# EAGLE design micro_RevA (EAGLE 6.5.0)
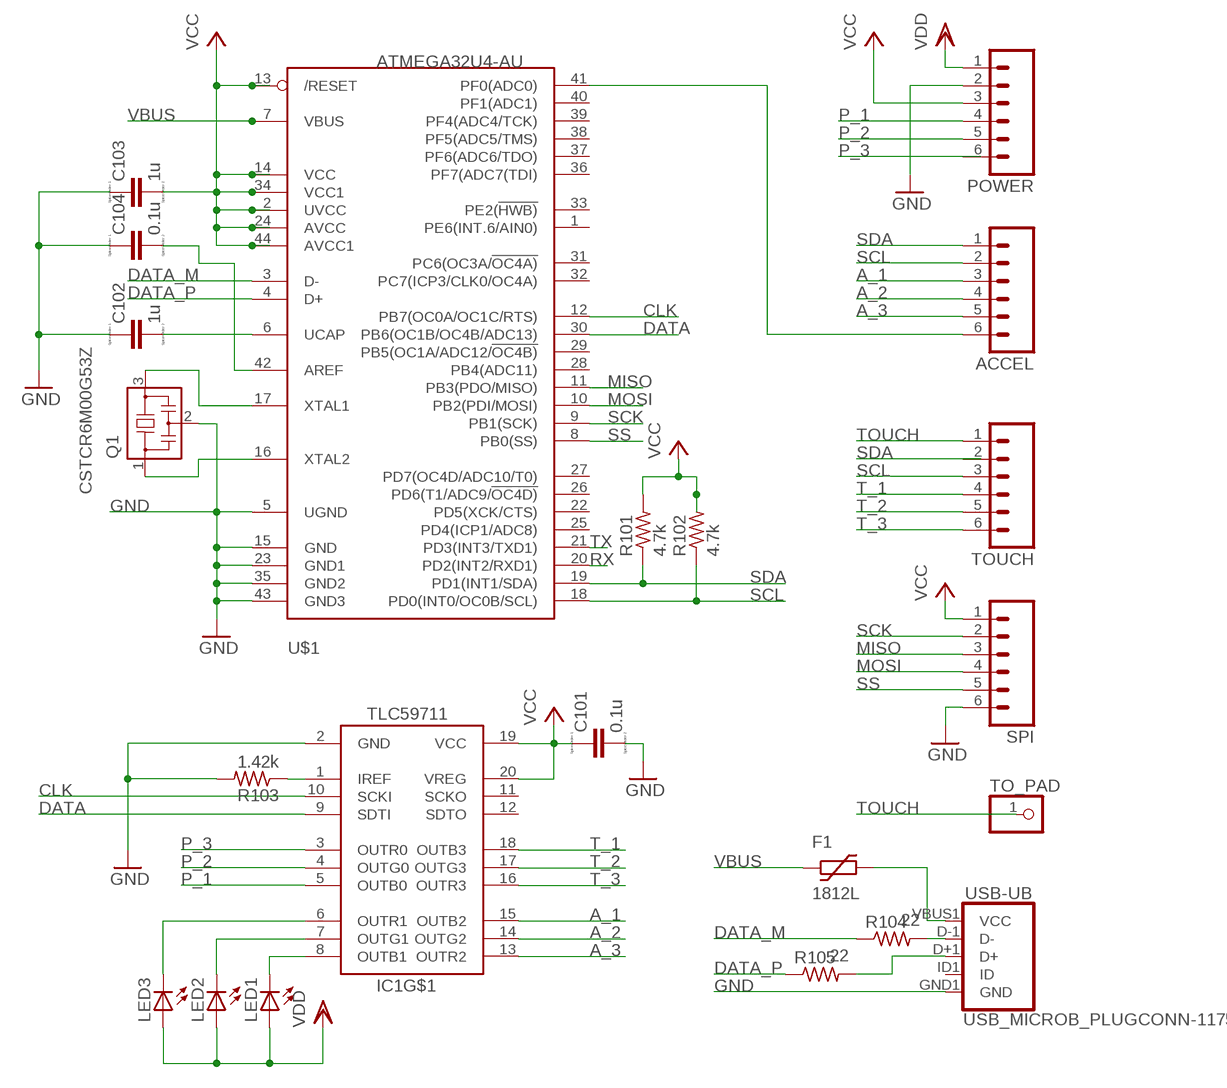
[diagram p0: schematic, sheet 1]

## Parts
ACCEL  M06SMD-STRAIGHT-ALT  [1X06_SMD_STRAIGHT_ALT]
C101  0.1u  CC0603  [C0603]
C102  1u  CC0603  [C0603]
C103  1u  CC0603  [C0603]
C104  0.1u  CC0603  [C0603]
F1  1812L  [1812L]
IC1  TLC59711  [HTSSOP20DAP]
LED1  LEDP-LCC-4  [P-LCC-4]
LED2  LEDP-LCC-4  [P-LCC-4]
LED3  LEDP-LCC-4  [P-LCC-4]
POWER  M06SMD-STRAIGHT-ALT  [1X06_SMD_STRAIGHT_ALT]
Q1  CSTCR6M00G53Z  [CSTCR6M]
R101  4.7k  R-US_R0603  [R0603]
R102  4.7k  R-US_R0603  [R0603]
R103  1.42k  R-US_R0603  [R0603]
R104  22  R-US_R0603  [R0603]
R105  22  R-US_R0603  [R0603]
SPI  M06SMD-STRAIGHT-ALT  [1X06_SMD_STRAIGHT_ALT]
TO_PAD  PINHD-1X1  [1X01]
TOUCH  M06SMD-STRAIGHT-ALT  [1X06_SMD_STRAIGHT_ALT]
U$1  ATMEGA32U4-AU  [TQFP44]
USB-UB  USB_MICROB_PLUGCONN-11752  [USB-B-MICRO-SMD_V03]

## Nets
A_1: ACCEL.3 IC1.15(OUTB2)
A_2: ACCEL.4 IC1.14(OUTG2)
A_3: ACCEL.5 IC1.13(OUTR2)
CLK: IC1.10(SCKI) U$1.12(PB7(OC0A/OC1C/RTS))
DATA: IC1.9(SDTI) U$1.30(PB6(OC1B/OC4B/ADC13))
DATA_M: R104.1 U$1.3(D-)
DATA_P: R105.1 U$1.4(D+)
GND: C101.2 C102.1 C103.1 C104.1 IC1.2(GND) POWER.2 Q1.2 R103.2 SPI.6 U$1.5(UGND) U$1.15(GND) U$1.23(GND1) U$1.35(GND2) U$1.43(GND3) USB-UB.GND1(GND)
MISO: SPI.3 U$1.11(PB3(PDO/MISO))
MOSI: SPI.4 U$1.10(PB2(PDI/MOSI))
N$1: Q1.3 U$1.17(XTAL1)
N$2: Q1.1 U$1.16(XTAL2)
N$3: C104.2 U$1.42(AREF)
N$4: IC1.1(IREF) R103.1
N$5: IC1.6(OUTR1) LED3.C@4(C)
N$6: IC1.7(OUTG1) LED2.C@4(C)
N$7: IC1.8(OUTB1) LED1.C@4(C)
N$8: C102.2 U$1.6(UCAP)
N$9: ACCEL.6 U$1.41(PF0(ADC0))
N$10: R104.2 USB-UB.D-1(D-)
N$11: R105.2 USB-UB.D+1(D+)
N$12: F1.P$2 USB-UB.VBUS1(VCC)
P_1: IC1.5(OUTB0) POWER.4
P_2: IC1.4(OUTG0) POWER.5
P_3: IC1.3(OUTR0) POWER.6
RX: U$1.20(PD2(INT2/RXD1))
SCK: SPI.2 U$1.9(PB1(SCK))
SCL: ACCEL.2 R102.1 TOUCH.3 U$1.18(PD0(INT0/OC0B/SCL))
SDA: ACCEL.1 R101.1 TOUCH.2 U$1.19(PD1(INT1/SDA))
SS: SPI.5 U$1.8(PB0(SS))
T_1: IC1.18(OUTB3) TOUCH.4
T_2: IC1.17(OUTG3) TOUCH.5
T_3: IC1.16(OUTR3) TOUCH.6
TOUCH: TO_PAD.1 TOUCH.1
TX: U$1.21(PD3(INT3/TXD1))
VBUS: F1.P$1 U$1.7(VBUS)
VCC: C101.1 C103.2 IC1.19(VCC) IC1.20(VREG) POWER.3 R101.2 R102.2 SPI.1 U$1.2(UVCC) U$1.13(/RESET) U$1.14(VCC) U$1.24(AVCC) U$1.34(VCC1) U$1.44(AVCC1)
VDD: LED1.A LED2.A LED3.A POWER.1
Unconnected: IC1.11(SCKO) IC1.12(SDTO) IC1.EXP(PAD) U$1.1(PE6(INT.6/AIN0)) U$1.22(PD5(XCK/CTS)) U$1.25(PD4(ICP1/ADC8)) U$1.26(PD6(T1/ADC9/!OC4D)) U$1.27(PD7(OC4D/ADC10/T0)) U$1.28(PB4(ADC11)) U$1.29(PB5(OC1A/ADC12/!OC4B)) U$1.31(PC6(OC3A/!OC4A)) U$1.32(PC7(ICP3/CLK0/OC4A)) U$1.33(PE2(!HWB)) U$1.36(PF7(ADC7(TDI)) U$1.37(PF6(ADC6/TDO)) U$1.38(PF5(ADC5/TMS)) U$1.39(PF4(ADC4/TCK)) U$1.40(PF1(ADC1)) USB-UB.ID1(ID)

## Library data of the parts
ACCEL POWER SPI TOUCH = SparkFun-Connectors:M06: Header 6 Standard 6-pin 0.1" header. Use with straight break away headers (SKU : PRT-00116), right angle break away headers (PRT-00553), swiss pins (PRT-00743), machine pins (PRT-00117), and female headers (PRT-00115). Molex polarized connector foot print use with SKU : PRT-08094 with associated crimp pins and housings. NOTES ON THE VARIANTS LOCK and LOCK_LONGPADS... This footprint was designed to help hold the alignment of a through-hole component (i.e. 6-pin header) while soldering it into place. You may notice that each hole has been shifted either up or down by 0.005 of an inch from it's more standard position (which is a perfectly straight line). This slight alteration caused the pins (the squares in the middle) to touch the edges of the holes. Because they are alternating, it causes a "brace" to hold the component in place. 0.005 has proven to be the perfect amount of "off-center" position when using our standard breakaway headers. Although looks a little odd when you look at the bare footprint, once you have a header in there, the alteration is very hard to notice. Also,if you push a header all the way into place, it is covered up entirely on the bottom side. This idea of altering the position of holes to aid alignment will be further integrated into the Sparkfun Library for other footprints. It can help hold any component with 3 or more connection pins.
C101-C104 = eagle-ltspice:C: CAPACITOR, European symbol; SPICEMODEL: NONE; SPICEPREFIX: C
F1 = ptc-littlefuse:1812L
IC1 = adafruit:TLC59711
LED1-LED3 = led:LED: LED OSRAM: - CHIPLED LG R971, LG N971, LY N971, LG Q971, LY Q971, LO R971, LY R971 LH N974, LH R974 LS Q976, LO Q976, LY Q976 LO Q996 - Hyper CHIPLED LW Q18S LB Q993, LB Q99A, LB R99A - SideLED LS A670, LO A670, LY A670, LG A670, LP A670 LB A673, LV A673, LT A673, LW A673 LH A674 LY A675 LS A676, LA A676, LO A676, LY A676, LW A676 LS A679, LY A679, LG A679 - Hyper Micro SIDELED® LS Y876, LA Y876, LO Y876, LY Y876 LT Y87S - SmartLED LW L88C, LW L88S LB L89C, LB L89S, LG L890 LS L89K, LO L89K, LY L89K LS L896, LA L896, LO L896, LY L896 - TOPLED LS T670, LO T670, LY T670, LG T670, LP T670 LSG T670, LSP T670, LSY T670, LOP T670, LYG T670 LG T671, LOG T671, LSG T671 LB T673, LV T673, LT T673, LW T673 LH T674 LS T676, LA T676, LO T676, LY T676, LB T676, LH T676, LSB T676, LW T676 LB T67C, LV T67C, LT T67C, LS T67K, LO T67K, LY T67K, LW E67C LS E67B, LA E67B, LO E67B, LY E67B, LB E67C, LV E67C, LT E67C LW T67C LS T679, LY T679, LG T679 LS T770, LO T770, LY T770, LG T770, LP T770 LB T773, LV T773, LT T773, LW T773 LH T774 LS E675, LA E675, LY E675, LS T675 LS T776, LA T776, LO T776, LY T776, LB T776 LHGB T686 LT T68C, LB T68C - Hyper Mini TOPLED® LB M676 - Mini TOPLED Santana® LG M470 LS M47K, LO M47K, LY M47K Source: http://www.osram.convergy.de LUXEON: - LUMILED® LXK2-PW12-R00, LXK2-PW12-S00, LXK2-PW14-U00, LXK2-PW14-V00 LXK2-PM12-R00, LXK2-PM12-S00, LXK2-PM14-U00 LXK2-PE12-Q00, LXK2-PE12-R00, LXK2-PE12-S00, LXK2-PE14-T00, LXK2-PE14-U00 LXK2-PB12-K00, LXK2-PB12-L00, LXK2-PB12-M00, LXK2-PB14-N00, LXK2-PB14-P00, LXK2-PB14-Q00 LXK2-PR12-L00, LXK2-PR12-M00, LXK2-PR14-Q00, LXK2-PR14-R00 LXK2-PD12-Q00, LXK2-PD12-R00, LXK2-PD12-S00 LXK2-PH12-R00, LXK2-PH12-S00 LXK2-PL12-P00, LXK2-PL12-Q00, LXK2-PL12-R00 Source: www.luxeon.com KINGBRIGHT: KA-3528ASYC Source: www.kingbright.com
Q1 = murata-filter:CSTCR: Resonator Source: murata.co.jp; MPN: CSTCR6M00G53-R0; OC_FARNELL: 1170434; OC_NEWARK: 25M8759
R101-R105 = resistor:R-US_: RESISTOR, American symbol
TO_PAD = pinhead:PINHD-1X1: PIN HEADER
U$1 = adafruit:ATMEGA32U4: http://www.ladyada.net/library/eagle
USB-UB = SparkFun-Connectors:USB_MICROB_PLUG: USB Micro-B connectors Some male, some female. Watch your step!; PROD_ID: CONN-11752

## Board
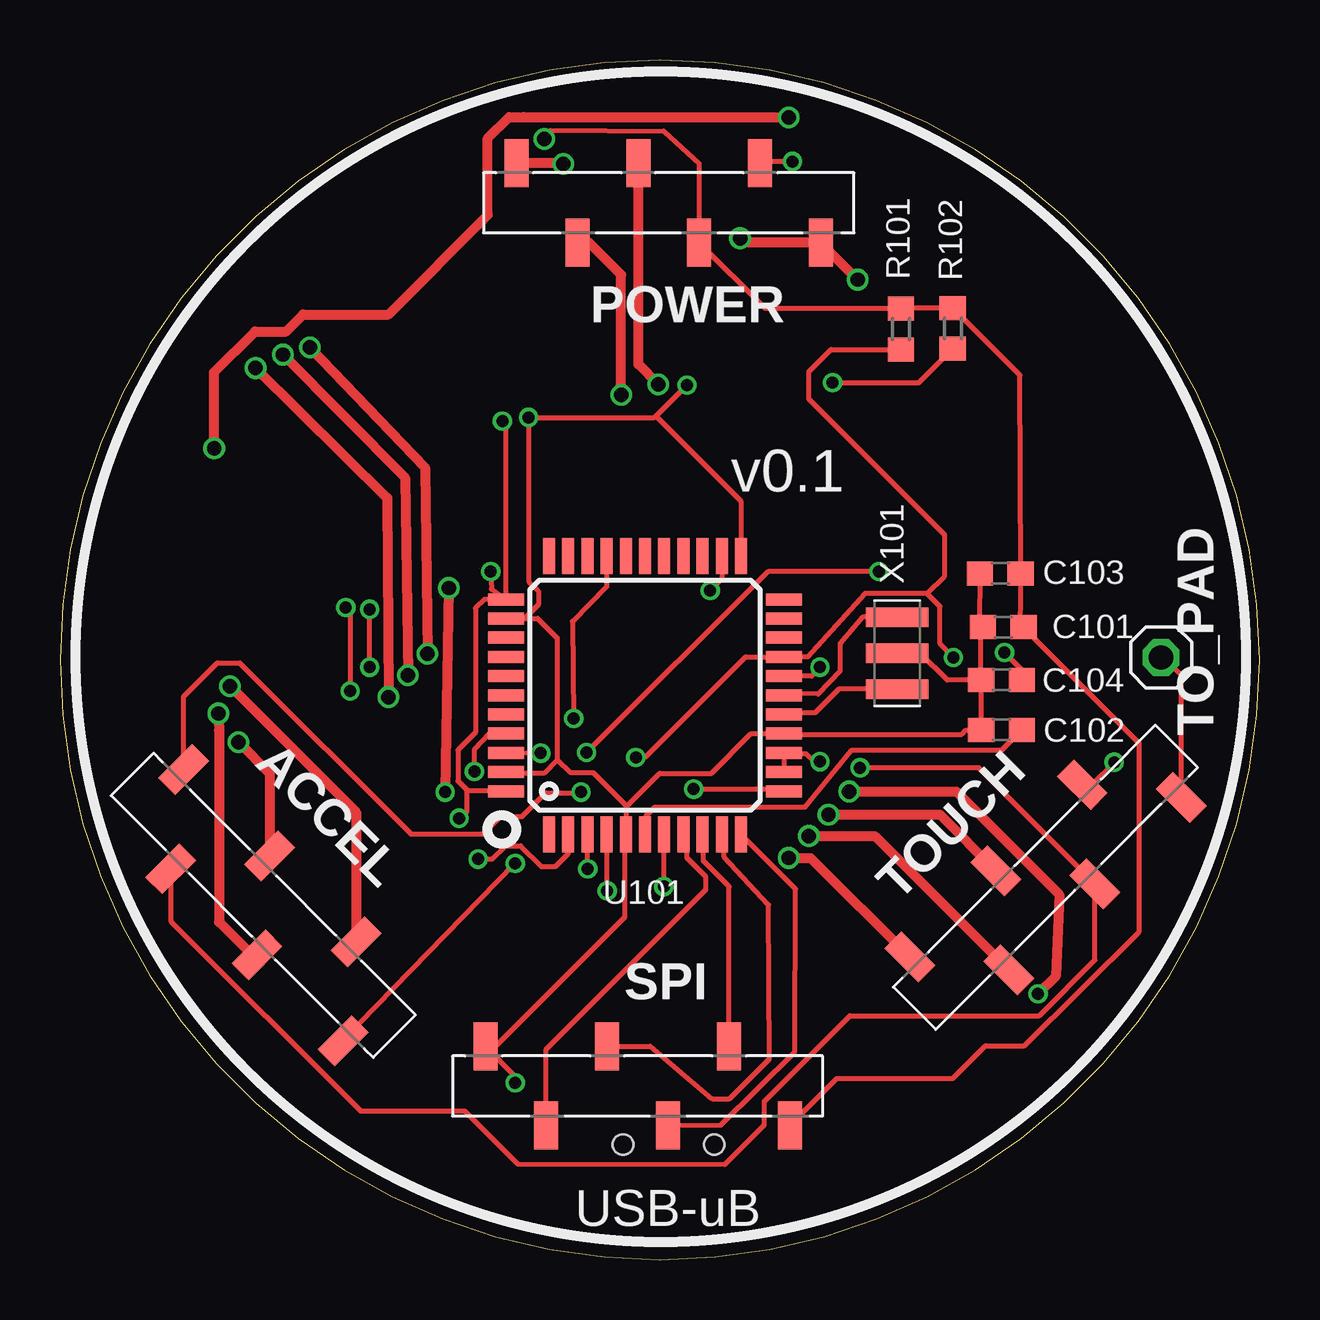
[diagram p1: board, top side]
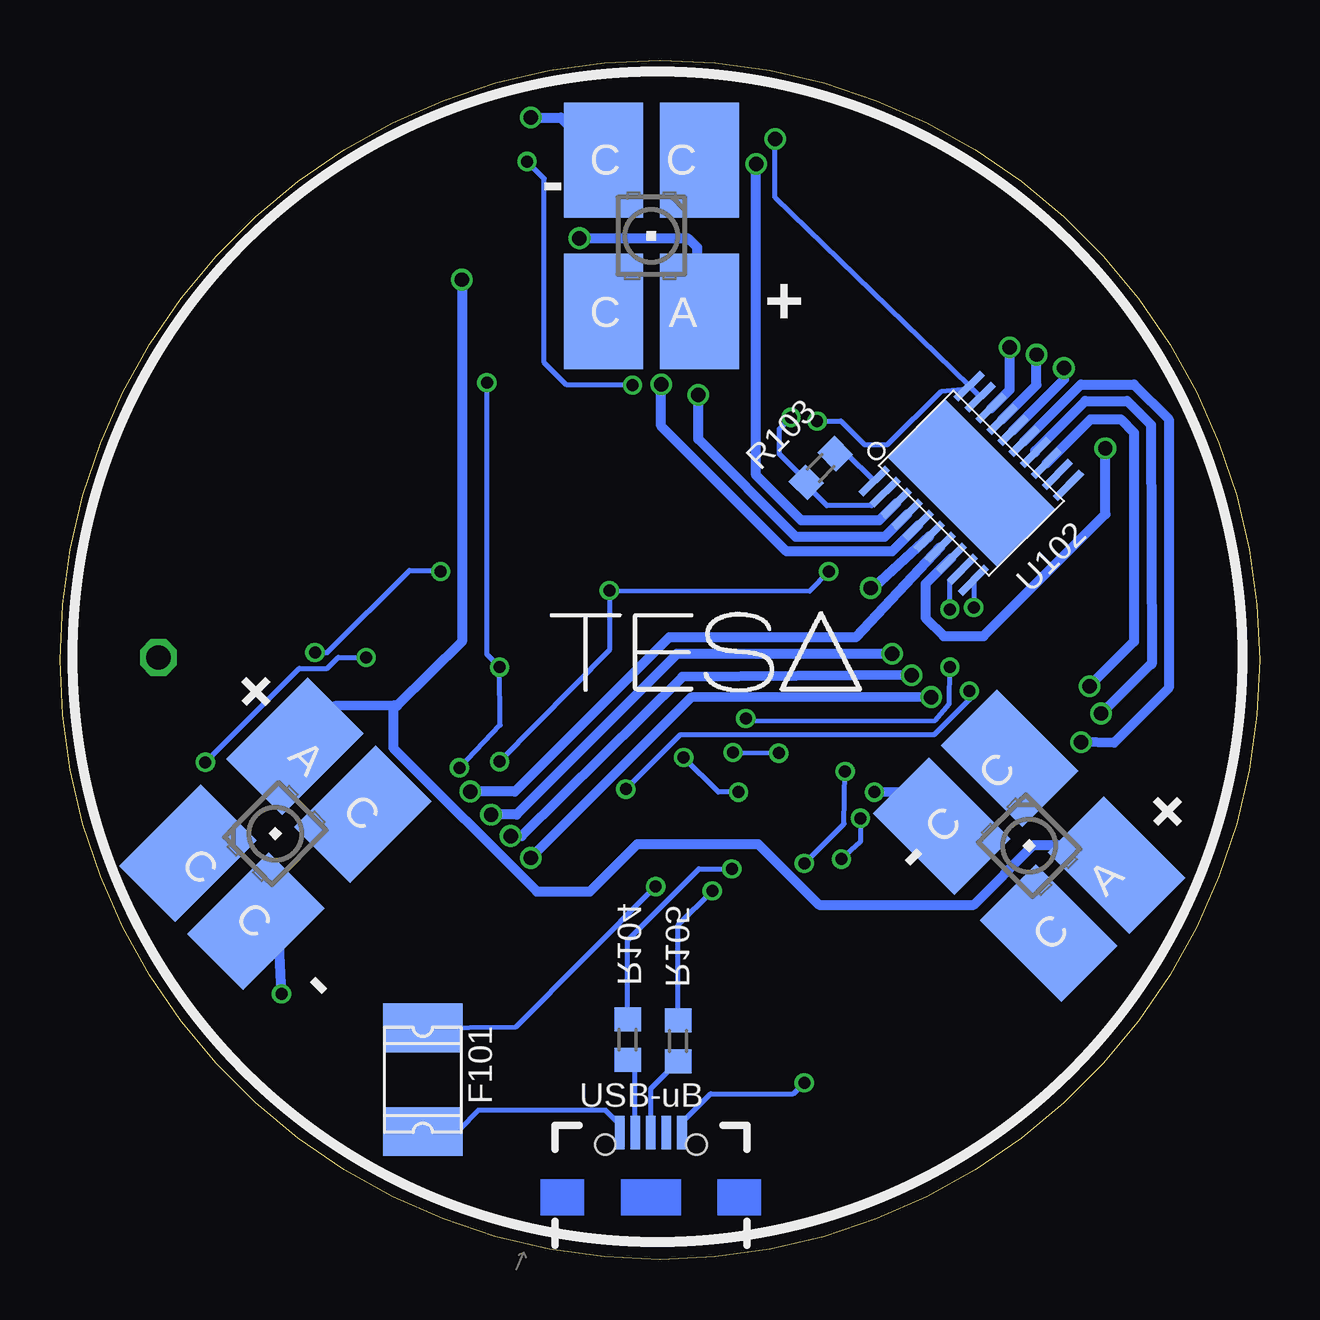
[diagram p2: board, bottom side, seen from below]

Size 50 x 50 mm. Coordinates in mm from the lower left corner, seen from the top.
Outline: 0,25 arc90 25,0 arc90 50,25 arc90 25,50 arc90 0,25
Copper layers (1*16): Top 0.035mm / dielectric 1.5mm / Bottom 0.035mm
Design rules "ITEADstudio_DRC": minimum track width 6mil, minimum drill 12mil, track to track 6mil, track to pad 6mil, pad to pad 6mil, via to via 6mil, smd to smd 0mil, copper to edge 10mil, drill to drill 10mil, minimum pad ring 10mil, minimum via ring 6mil, stop-mask expansion 2mil, vias tented up to drill 100mil, thermal gap 10mil

### Footprints (pad centres in the part's own frame; a part is rotated, then mirrored left to right if it is on the bottom)
1X06_SMD_STRAIGHT_ALT = smd 1 x 2: 1 0,-1.65; 2 -2.54,1.65; 3 -5.08,-1.65; 4 -7.62,1.65; 5 -10.16,-1.65; 6 -12.7,1.65
C0603 = smd 1.1 x 1: 1 -0.85,0; 2 0.85,0
1812L = smd 2.03 x 3.3: P$1 -2.16,0; P$2 2.16,0
HTSSOP20DAP = smd 0.3 x 1.55: 1 -2.925,-2.8; 2 -2.275,-2.8; 3 -1.625,-2.8; 4 -0.975,-2.8; 5 -0.325,-2.8; 6 0.325,-2.8; 7 0.975,-2.8; 8 1.625,-2.8; 9 2.275,-2.8; 10 2.925,-2.8; 11 2.925,2.8; 12 2.275,2.8; 13 1.625,2.8; 14 0.975,2.8; 15 0.325,2.8; 16 -0.325,2.8; 17 -0.975,2.8; 18 -1.625,2.8; 19 -2.275,2.8; 20 -2.925,2.8 | smd 6.5 x 3.4: EXP 0,0
P-LCC-4 = smd 3.3 x 4.8: A -2,3.15; C@1 -2,-3.15; C@3 2,3.15; C@4 2,-3.15
CSTCR6M = smd 0.8 x 2.6: 1 -1.5,0; 2 0,0; 3 1.5,0
R0603 = smd 1 x 1.1: 1 -0.85,0; 2 0.85,0
1X01 = drill 1.016 octagon: 1 0,0
TQFP44 = smd 1.5 x 0.5: 1 -5.8,4; 2 -5.8,3.2; 3 -5.8,2.4; 4 -5.8,1.6; 5 -5.8,0.8; 6 -5.8,0; 7 -5.8,-0.8; 8 -5.8,-1.6; 9 -5.8,-2.4; 10 -5.8,-3.2; 11 -5.8,-4; 23 5.8,-4; 24 5.8,-3.2; 25 5.8,-2.4; 26 5.8,-1.6; 27 5.8,-0.8; 28 5.8,0; 29 5.8,0.8; 30 5.8,1.6; 31 5.8,2.4; 32 5.8,3.2; 33 5.8,4 | smd 0.5 x 1.5: 12 -4,-5.8; 13 -3.2,-5.8; 14 -2.4,-5.8; 15 -1.6,-5.8; 16 -0.8,-5.8; 17 0,-5.8; 18 0.8,-5.8; 19 1.6,-5.8; 20 2.4,-5.8; 21 3.2,-5.8; 22 4,-5.8; 34 4,5.8; 35 3.2,5.8; 36 2.4,5.8; 37 1.6,5.8; 38 0.8,5.8; 39 0,5.8; 40 -0.8,5.8; 41 -1.6,5.8; 42 -2.4,5.8; 43 -3.2,5.8; 44 -4,5.8
USB-B-MICRO-SMD_V03 = smd 1.4 x 0.4: D+1 2.7,0; D-1 2.7,0.65; GND1 2.7,-1.3; ID1 2.7,-0.65; VBUS1 2.7,1.3 | hole 0.85: 2.2,1.9; 2.2,-1.9

### Placement (x,y rotation side)
ACCEL  3.99,19.25 135 top
C101  39.32,26.37 180 top
C102  39.24,22.07 0 top
C103  39.19,28.6 0 top
C104  39.24,24.16 0 top
F1  34.87,7.49 270 bottom
IC1  12.01,32.36 315 bottom
LED1  25.35,42.67 180 bottom
LED2  41.02,17.75 315 bottom
LED3  9.6,17.25 225 bottom
POWER  31.72,44.04 0 top
Q1  34.9,25.27 90 top
R101  35.05,38.79 90 top
R102  37.21,38.81 90 top
R103  18.29,32.99 225 bottom
R104  26.34,9.17 270 bottom
R105  24.23,9.12 270 bottom
SPI  30.43,7.24 0 top
TO_PAD  45.9,25.1 0 top
TOUCH  45.57,20.42 45 top
U$1  24.38,23.52 90 top
USB-UB  25.37,2.59 90 bottom

### Tracks (layer width: path | path; a pad name or v marks a point on that pad's centre or on a via)
A_1  (via drill 0.6)
  Top 0.406: v7.44,21.57 8.75,20.26 ACCEL.3
  Bottom 0.406: IC1.15 7.44,36.47 5.23,36.47 3.79,35.03 3.79,23.82 6.07,21.54 v7.44,21.57
A_2  (via drill 0.6)
  Top 0.406: v6.6,22.76 6.63,22.07 6.63,14.07 8,12.7 ACCEL.4
  Bottom 0.406: IC1.14 9.35,33.71 7.26,35.79 5.51,35.79 4.52,34.8 4.5,24.82 4.57,24.79 v6.6,22.76
A_3  (via drill 0.6)
  Top 0.406: v7.09,23.9 12.34,18.65 ACCEL.5
  Bottom 0.406: IC1.13 8.87,33.19 7.04,35.03 5.79,35.03 5.23,34.47 5.23,25.76 v7.09,23.9
CLK  (via drill 0.5)
  Top 0.203: v11.91,27.18 12.09,27 v12.09,23.7 | v26.42,19.61 30.1,19.61 U$1.12
  Bottom 0.203: IC1.10 11.91,28.3 v11.91,27.18 | v12.09,23.7 12.09,23.34 13.56,21.87 24.16,21.87 v26.42,19.61
DATA  (via drill 0.5)
  Top 0.203: U$1.30 22.78,28.04 21.36,26.59 v21.41,22.55 | v12.9,24.69 v12.9,27.1
  Bottom 0.203: v21.41,22.55 21.41,22.45 13.51,22.48 12.93,23.16 v12.9,24.69 | v12.9,27.1 12.9,28.32 12.45,28.77 IC1.9
DATA_M  (via drill 0.5)
  Top 0.203: v22,16.28 22,17.71 U$1.3
  Bottom 0.203: R104.1 26.34,13.31 23.37,16.28 v22,16.28
DATA_P  (via drill 0.5)
  Top 0.203: v22.81,15.37 22.81,17.7 U$1.4
  Bottom 0.203: R105.1 24.23,13.95 v22.81,15.37
GND  (via drill 0.5)
  Top 0.203: C104.1 36.98,24.16 35.89,25.25 34.92,25.25 Q1.2 | C104.1 38.39,26.29 C101.2 38.32,26.52 C103.1 | C104.1 C102.1 37.77,22.07 37.59,21.89 30.21,21.89 U$1.15 28.8,21.92 27.15,20.27 25,20.27 23.58,18.86 | 19.36,26.72 19.94,27.3 19.94,27.86 19.53,28.27 v19.53,35.1 24.79,35.1 24.84,35.15 | 19.36,26.72 U$1.35 | 24.84,35.15 v26.14,36.45 | v18.97,7.37 18.97,7.64 SPI.6 18.16,8.89 23.55,14.28 23.55,17.68 U$1.5 23.58,18.86 | 19.36,26.72 19.91,26.72 20.73,25.91 20.73,20.85 | 20.73,20.85 20.73,20.83 20.17,20.27 18.64,20.27 U$1.43 | 20.73,20.85 21.29,20.3 22.23,20.3 23.58,18.94 23.58,18.86 | v30.53,45.77 29.26,45.77 POWER.2 | 24.84,35.15 28.38,31.61 U$1.23
  Bottom 0.203: IC1.2 16.17,31.42 18.03,31.42 18.89,32.27 R103.2 18.89,32.45 20.02,33.58 20.02,34.62 v19.53,35.1 | v26.14,36.45 28.88,36.45 29.82,37.39 29.82,45.06 v30.53,45.77 | USB-UB.GND1 24.07,5.72 22.89,6.91 19.43,6.91 v18.97,7.37
MISO
  Top 0.203: SPI.3 27.56,5.61 30.63,8.66 30.66,15.45 U$1.11
MOSI
  Top 0.203: SPI.4 24.61,8.89 27.18,6.71 27.91,6.71 29.57,8.36 29.54,14.78 27.69,16.79 27.69,17.62 U$1.10
N$1
  Top 0.203: Q1.3 33.45,26.77 32.51,25.68 32.51,24.54 31.6,23.57 30.26,23.6 U$1.17
N$2
  Top 0.203: Q1.1 32.46,23.77 31.47,22.78 30.25,22.78 U$1.16
N$3  (via drill 0.5)
  Top 0.203: C104.2 40.09,24.57 v39.37,25.3 | v34.14,28.68 29.52,28.68 v21.95,21.13 | v20.04,21.11 18.62,21.08 U$1.42
  Bottom 0.203: v39.37,25.3 38.86,25.3 35.43,28.73 34.19,28.73 v34.14,28.68 | v21.95,21.13 v20.04,21.11
N$4
  Bottom 0.203: IC1.1 17.21,33.6 R103.1
N$5  (via drill 0.5, 0.6)
  Top 0.406: v16.2,27.99 v16.05,19.48
  Bottom 0.406: IC1.6 16.08,28.04 v16.2,27.99 | v16.05,19.48 14.66,19.51 14.2,19.05 14.17,18.99 LED3.C@4
N$6  (via drill 0.5, 0.6)
  Top 0.406: v32.89,19.51 37.36,19.51 41.66,15.21 41.5,11.81 v40.77,11.07
  Bottom 0.406: IC1.7 16.83,25.93 24.61,25.93 31.04,19.51 v32.89,19.51 | v40.77,11.07 40.87,13.15 LED2.C@4
N$7  (via drill 0.6)
  Top 0.406: v6.43,33.81 6.43,36.98 8.13,38.68 9.42,38.68 10.13,39.4 13.69,39.4 17.83,43.54 17.83,46.74 18.72,47.62 19.3,47.62 19.33,47.62 30.35,47.62 v30.38,47.6
  Bottom 0.406: IC1.8 13.92,28.16 13.92,26.75 13.16,25.98 11.51,25.98 6.43,31.06 v6.43,33.81 | v30.38,47.6 29.13,47.6 LED1.C@4
N$8
  Top 0.203: C102.2 39.23,21.21 32.97,21.21 31.04,18.85 24.79,18.85 24.41,18.47 24.41,17.75 U$1.6
N$9  (via drill 0.5)
  Top 0.203: ACCEL.6 11.75,9.1 v18.97,16.51 | v17.27,20.34 17.27,21.26 17.93,21.95 18.56,21.95 U$1.41
  Bottom 0.203: v18.97,16.51 17.32,18.16 v17.27,20.34
N$10
  Bottom 0.203: USB-UB.D-1 26.02,8 R104.2
N$11
  Bottom 0.203: USB-UB.D+1 25.38,7.13 R105.2
N$12
  Bottom 0.203: USB-UB.VBUS1 26.68,5.64 27.25,6.22 32.56,6.22 33.35,5.44 34.77,5.44 F1.P$2
P_1  (via drill 0.6)
  Top 0.406: v24.94,36.47 24.11,37.31 POWER.4
  Bottom 0.406: IC1.5 15.32,29.52 19.71,29.52 24.94,34.75 v24.94,36.47
P_2  (via drill 0.6)
  Top 0.406: v23.39,36.04 23.39,41.05 22.05,42.39 POWER.5
  Bottom 0.406: IC1.4 15.63,30.12 19.33,30.12 23.39,34.19 v23.39,36.04
P_3  (via drill 0.6)
  Top 0.406: v20.98,45.67 20.68,45.69 POWER.6
  Bottom 0.406: IC1.3 15.86,30.81 19.1,30.81 20.98,32.69 v20.98,45.67
SCK
  Top 0.203: SPI.2 27.89,15.54 26.82,16.61 26.82,17.68 U$1.9
SCL  (via drill 0.5)
  Top 0.203: v33.35,20.5 38.31,20.5 TOUCH.3 43.14,12.48 40.82,10.16 32.92,10.16 29.36,6.6 29.36,5.61 27.71,3.96 19.07,3.99 16.87,6.2 12.52,6.2 4.62,14.1 ACCEL.2 | v31.67,24.69 31.33,24.32 U$1.18 | v32.21,36.55 35.8,36.55 R102.1
  Bottom 0.203: v33.35,20.5 31.65,22.28 v31.67,24.69 32.21,25.22 v32.21,36.55
SDA  (via drill 0.5)
  Top 0.203: TOUCH.2 43.01,19.79 v43.94,20.73 | v37.24,25.09 36.68,25.68 36.68,27.23 36.14,27.76 | 36.14,27.76 33.55,27.76 31.17,25.12 U$1.19 28.57,25.12 24.38,20.93 v24,20.93 | ACCEL.1 5.16,23.47 6.55,24.87 7.49,24.87 14.63,17.73 17.63,17.73 18.36,18.47 19.25,18.47 20.24,19.46 21.69,19.46 v21.72,19.48 | 36.14,27.76 36.88,28.5 36.88,30.2 31.22,35.87 31.22,37.01 32.15,37.94 R101.1
  Bottom 0.203: v43.94,20.73 40.03,24.64 38.86,24.64 38.41,25.09 v37.24,25.09 | v21.72,19.48 22.55,19.48 v24,20.93
SS
  Top 0.203: SPI.5 20.27,8.76 26.92,15.42 26.92,15.95 26.14,16.74 26.14,17.57 U$1.8
T_1  (via drill 0.6)
  Top 0.406: v10.41,38.02 15.21,33.02 v15.32,25.25 | v32.03,18.54 36.67,18.54 TOUCH.4
  Bottom 0.406: IC1.18 10.41,36.26 v10.41,38.02 | v15.32,25.25 24.28,25.25 30.96,18.54 v32.03,18.54
T_2  (via drill 0.6)
  Top 0.406: v9.3,37.72 14.38,32.59 v14.5,24.36 | v31.22,17.65 33.97,17.65 TOUCH.5
  Bottom 0.406: IC1.17 9.3,36.46 v9.3,37.72 | v14.5,24.36 24.05,24.28 30.76,17.65 v31.22,17.65
T_3  (via drill 0.6)
  Top 0.406: v8.15,37.16 13.64,31.75 v13.69,23.44 | v30.38,16.74 31.29,16.74 TOUCH.6
  Bottom 0.406: IC1.16 8.15,36.68 v8.15,37.16 | v13.69,23.44 23.7,23.42 v30.38,16.74
TOUCH
  Top 0.203: TOUCH.1 46.73,24.36 TO_PAD.1
VBUS  (via drill 0.5)
  Top 0.203: v25.17,15.54 25.17,17.71 U$1.7
  Bottom 0.203: F1.P$1 30.99,9.7 v25.17,15.54
VCC  (via drill 0.5, 0.6)
  Top 0.203: v20.19,46.71 20.45,47.07 25.17,47.04 26.64,45.7 POWER.3 29.4,39.64 R101.2 35.08,39.66 R102.2 40.02,36.85 C103.2 40.02,26.52 C101.1 40.17,26.33 44.98,21.51 44.98,13.66 40.21,8.91 38.58,8.91 37.21,7.54 32.38,7.54 SPI.1 | U$1.34 18.58,34.81 v18.44,34.95 | U$1.24 27.58,28.37 v27.1,27.89 | v17.96,28.68 17.98,27.94 U$1.34 | U$1.13 U$1.14 30.22,21.08 31.09,21.08 31.42,20.75 v31.67,20.75 | U$1.34 17.69,27.52 17.32,27.15 17.32,21.97 16.59,21.23 16.59,19.94 16.94,19.58 16.94,19.56 | 16.94,19.56 16.94,18.64 v16.64,18.39 | v17.42,16.69 18.01,16.69 18.57,17.25 19.2,17.25 20.07,16.38 20.65,16.38 21.18,16.92 U$1.2 | U$1.2 | 16.94,19.56 18.55,19.56 U$1.44
  Bottom 0.203: IC1.20 IC1.19 | IC1.20 20.19,44.27 v20.19,46.71 | v18.44,34.95 17.45,34.95 16.46,33.96 15.52,33.96 13.26,36.2 12.19,36.3 IC1.20 | v17.96,28.68 18.75,27.86 v27.1,27.89 27.1,25.4 v31.67,20.75 | v16.64,18.39 16.64,17.4 v17.42,16.69
VDD  (via drill 0.6)
  Top 0.406: v28.35,42.57 28.52,42.39 POWER.1 31.73,42.37 v33.25,40.84
  Bottom 0.406: v28.35,42.57 23.82,42.57 23.44,42.19 23.44,39.62 LED1.A | v33.25,40.84 33.25,25.76 35.94,23.09 36.11,23.09 | 36.11,23.09 38.54,23.06 LED2.A | 36.11,23.09 36.11,21.32 30.12,15.34 27.91,15.34 25.93,17.32 20.9,17.32 18.36,14.78 11.91,14.78 9.42,17.27 6.8,17.27 LED3.A

### Text on the board
tPlace: v0.1 | X101 | U101 | USB-uB
bPlace: - | + | U102 | + | + | - | - | F101 | USB-uB